# EAGLE design asynclabs_wishield_v2 (EAGLE 5.06)
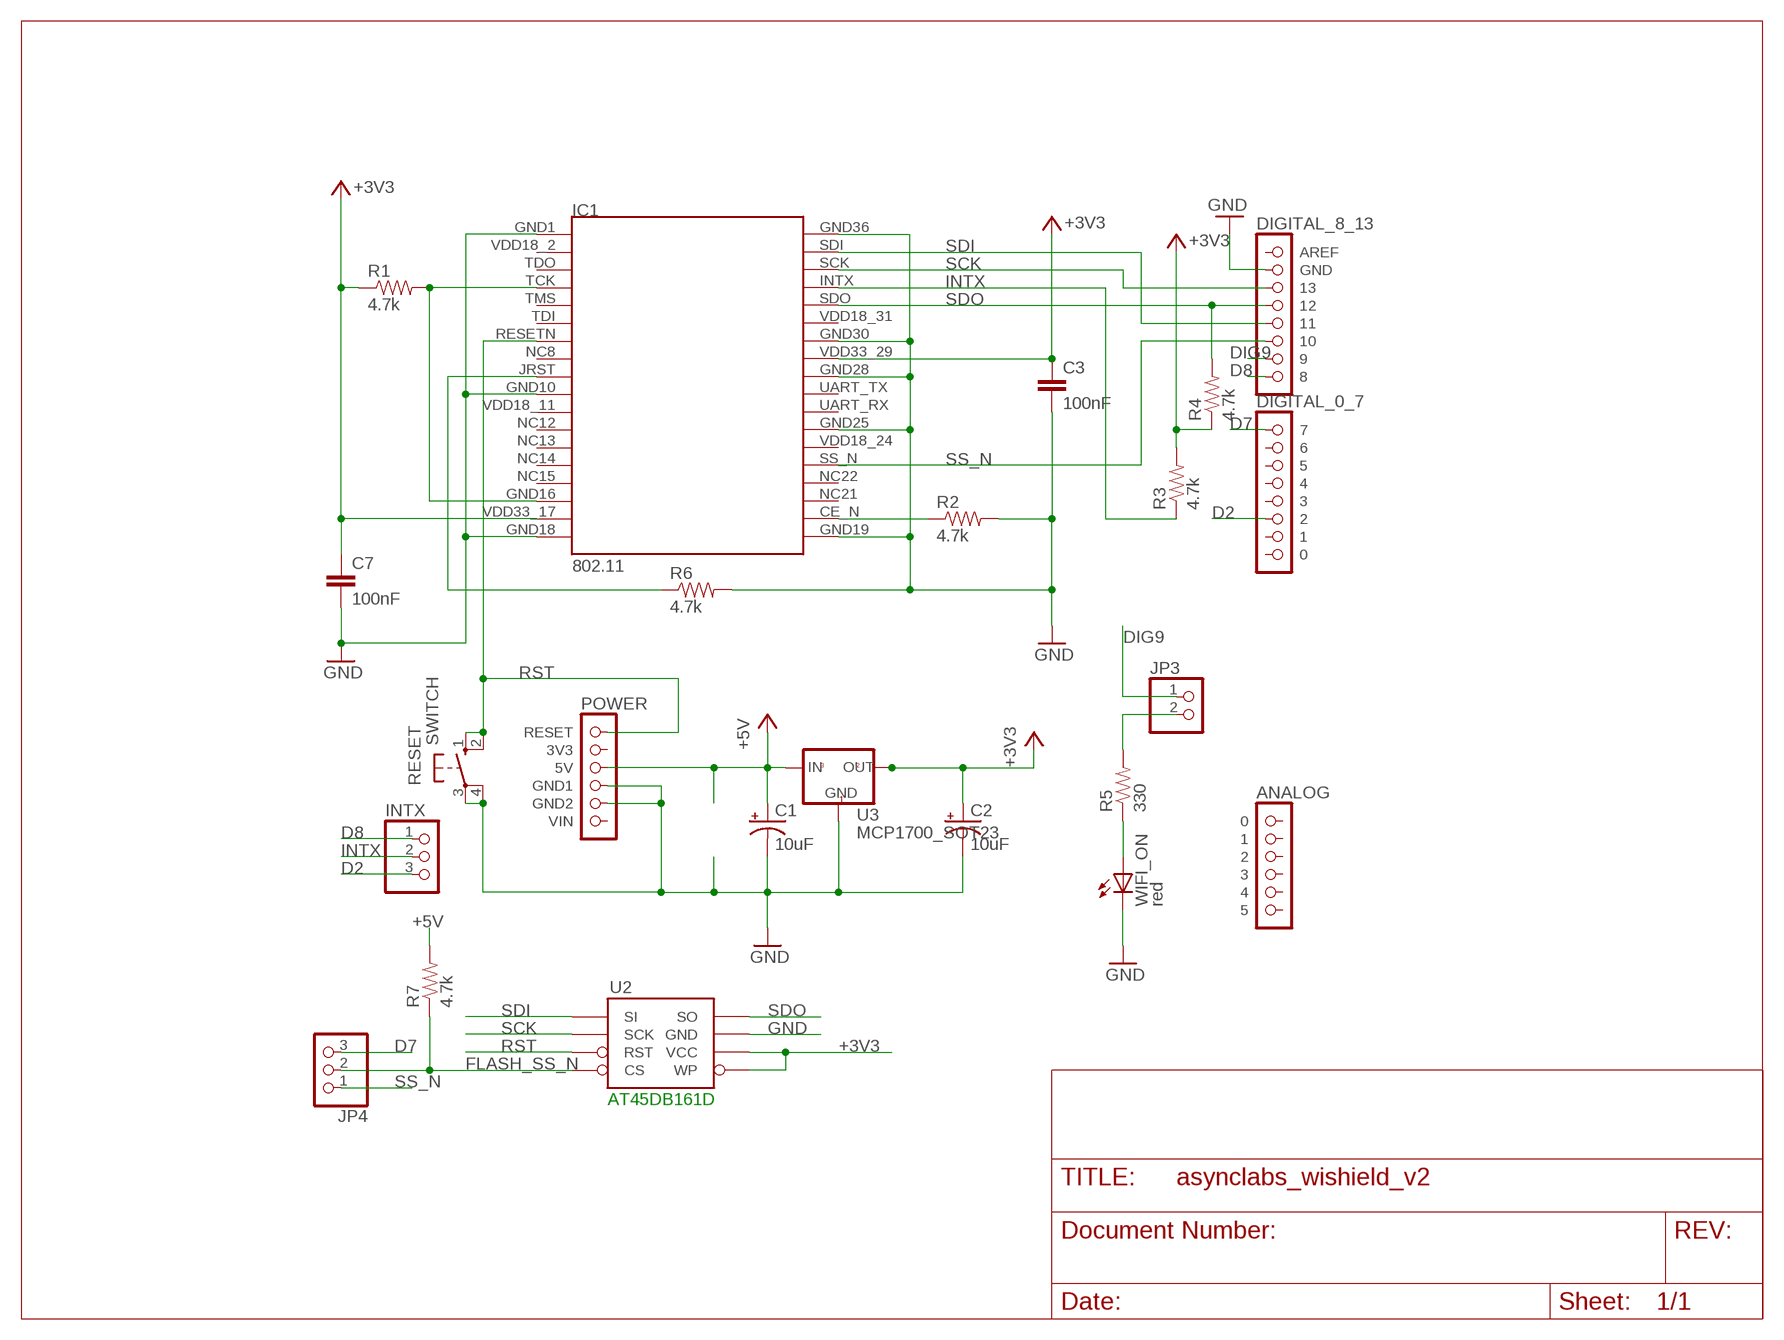
[diagram p0: schematic, sheet 1]

## Parts
C1  10uF  CAP_POL1206  [EIA3216]
C2  10uF  CAP_POL1206  [EIA3216]
C3  100nF  CAPACITOR0603-CAP  [0603-CAP]
C7  100nF  CAPACITOR0603-CAP  [0603-CAP]
IC1  802.11  ZG2100MOD  [ZG2100MOD]
INTX  PINHD3  [PINHD3]
JP3  PINHD2  [PINHD2]
JP4  PINHD3  [PINHD3]
R1  4.7k  RESISTOR0603-RES  [0603-RES]
R2  4.7k  RESISTOR0603-RES  [0603-RES]
R3  4.7k  RESISTOR0603-RES  [0603-RES]
R4  4.7k  RESISTOR0603-RES  [0603-RES]
R5  330  RESISTOR0603-RES  [0603-RES]
R6  4.7k  RESISTOR0603-RES  [0603-RES]
R7  4.7k  RESISTOR0603-RES  [0603-RES]
RESET  SWITCH  [SWITCH]
U2  AT45DB041B  [SO08]
U3  MCP1700_SOT23  [SOT23-3]
U$1  POWER  [1X06]
U$2  ANALOG  [1X06]
U$3  DIGITAL_0_7  [1X08]
U$4  DIGITAL_8_13  [1X08]
WIFI_ON  red  LED0603  [LED-0603]

## Nets
+3V3: C2.A(+) C3.1 C7.1 IC1.VDD33_17 IC1.VDD33_29 R1.1 R3.2 R4.1 U2.5(WP) U2.6(VCC) U3.2(OUT)
+5V: C1.A(+) R7.2 U3.3(IN) U$1.3(5V)
CE_N: IC1.CE_N R2.1
D2: INTX.3 U$3.6
D7: JP4.3 U$3.1
D8: INTX.1 U$4.8
DIG9: JP3.1 U$4.7
FLASH_SS_N: JP4.2 R7.1 U2.4(CS)
GND: C1.C(-) C2.C(-) C3.2 C7.2 IC1.GND1 IC1.GND10 IC1.GND18 IC1.GND19 IC1.GND25 IC1.GND28 IC1.GND30 IC1.GND36 R2.2 R6.2 RESET.3(P) RESET.4(P1) U2.7(GND) U3.1(GND) U$1.4(GND1) U$1.5(GND2) U$4.2(GND) WIFI_ON.C
INTX: IC1.INTX INTX.2 R3.1
JRST: IC1.JRST R6.1
N$1: JP3.2 R5.2
N$2: R5.1 WIFI_ON.A
RST: IC1.RESETN(RSTN) RESET.1(S) RESET.2(S1) U2.3(RST) U$1.1(RESET)
SCK: IC1.SCK U2.2(SCK) U$4.3
SDI: IC1.SDI U2.1(SI) U$4.5
SDO: IC1.SDO R4.2 U2.8(SO) U$4.4
SS_N: IC1.SS_N JP4.1 U$4.6
VDD_TIE: IC1.GND16 IC1.TCK R1.2
Unconnected: IC1.NC8 IC1.NC12 IC1.NC13 IC1.NC14 IC1.NC15 IC1.NC21 IC1.NC22 IC1.TDI IC1.TDO IC1.TMS IC1.UART_RX IC1.UART_TX IC1.VDD18_2 IC1.VDD18_11 IC1.VDD18_24 IC1.VDD18_31 U$1.2(3V3) U$1.6(VIN) U$2.1 U$2.2 U$2.3 U$2.4 U$2.5 U$2.6 U$3.2 U$3.3 U$3.4 U$3.5 U$3.7 U$3.8 U$4.1(AREF)

## Notes on the sheet
- AT45DB161D

## Library data of the parts
C1 C2 = asynlabs:CAP_POL: Capacitor Polarized These are standard SMD and PTH capacitors. Normally 10uF, 47uF, and 100uF in electrolytic and tantalum varieties. Always verify the external diameter of the through hole cap, it varies with capacity, voltage, and manufacturer. The EIA devices should be standard.
C3 C7 = asynlabs:CAPACITOR: Capacitor Standard 0603 ceramic capacitor, and 0.1" leaded capacitor.
IC1 = ZGLIB:ZG2100MOD: ZG2100 Module
INTX JP4 = ZGLIB:PINHD3
JP3 = ZGLIB:PINHD2
R1-R7 = asynlabs:RESISTOR: Resistor Basic schematic elements and footprints for 0603, 1206, and PTH 1/10th watt (small) resistors.
RESET = asynlabs:SWITCH
U2 = asynlabs:AT45DB041B
U3 = asynlabs:MCP1700_SOT23
U$1 = arduino:POWER
U$2 = arduino:ANALOG
U$3 = arduino:DIGITAL_0_7
U$4 = arduino:DIGITAL_8_13
WIFI_ON = asynlabs:LED: LEDs Standard schematic elements and footprints for 5mm, 3mm, 1206, and 0603 sized LEDs. 5mm - Spark Fun Electronics SKU : COM-00529 (and others)

## Board
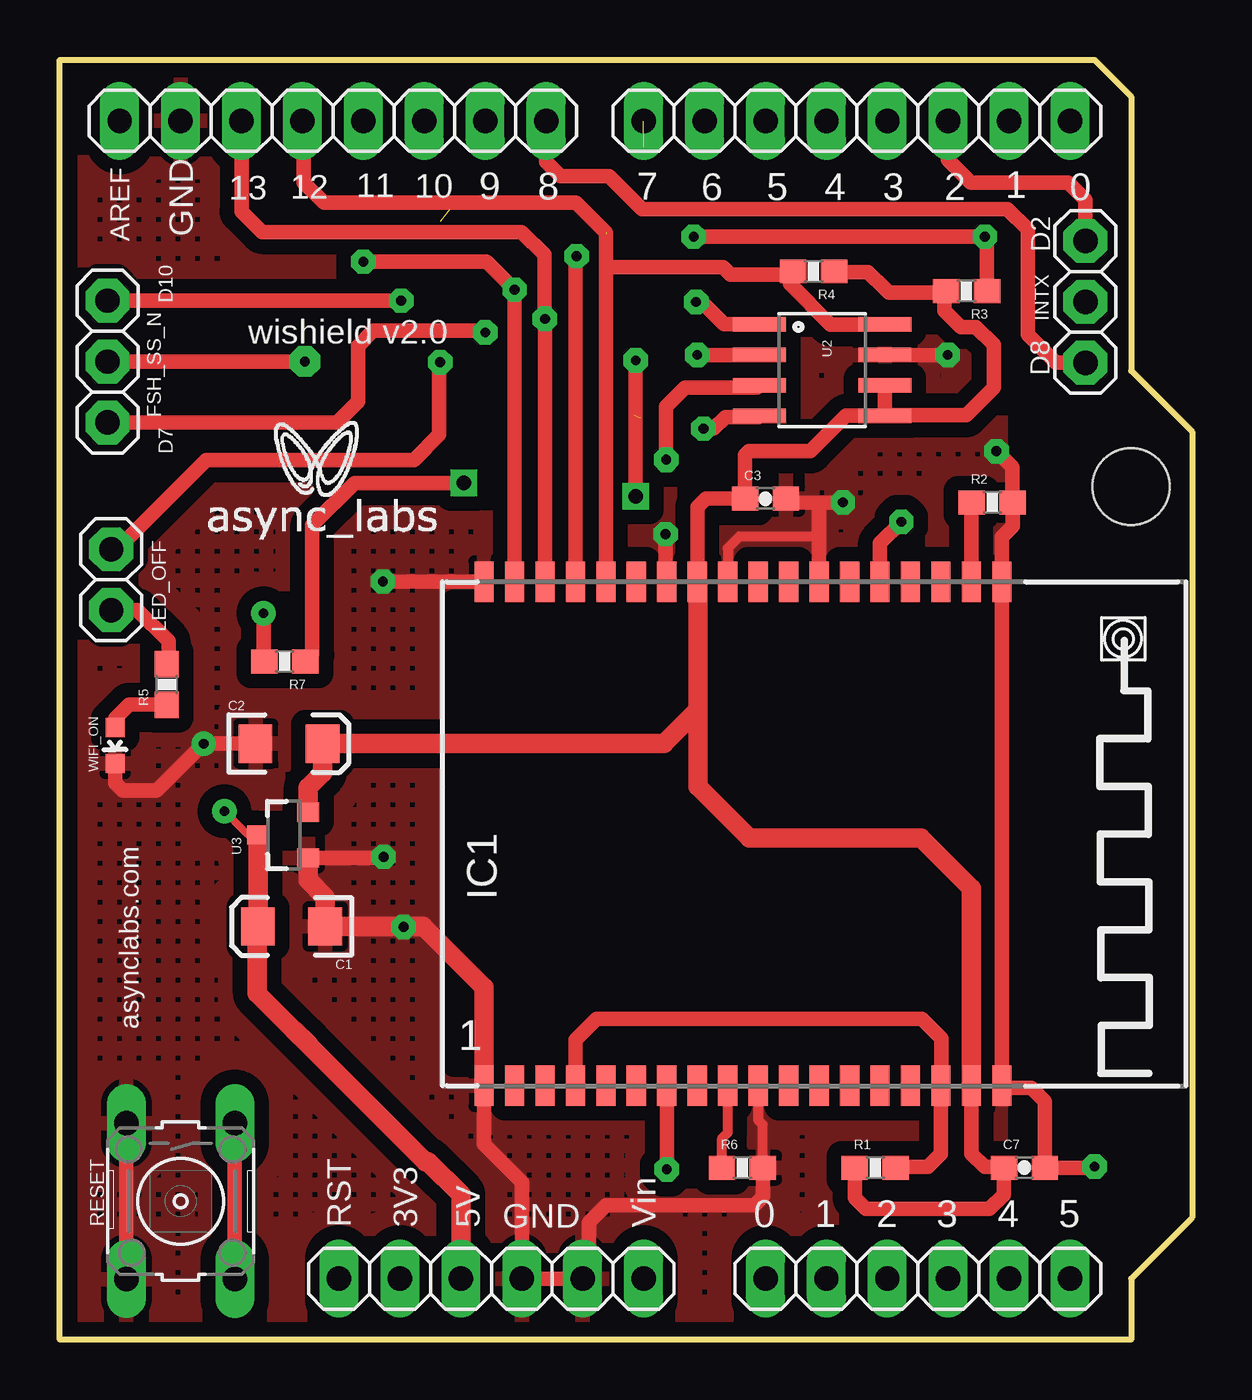
[diagram p1: board, top side]
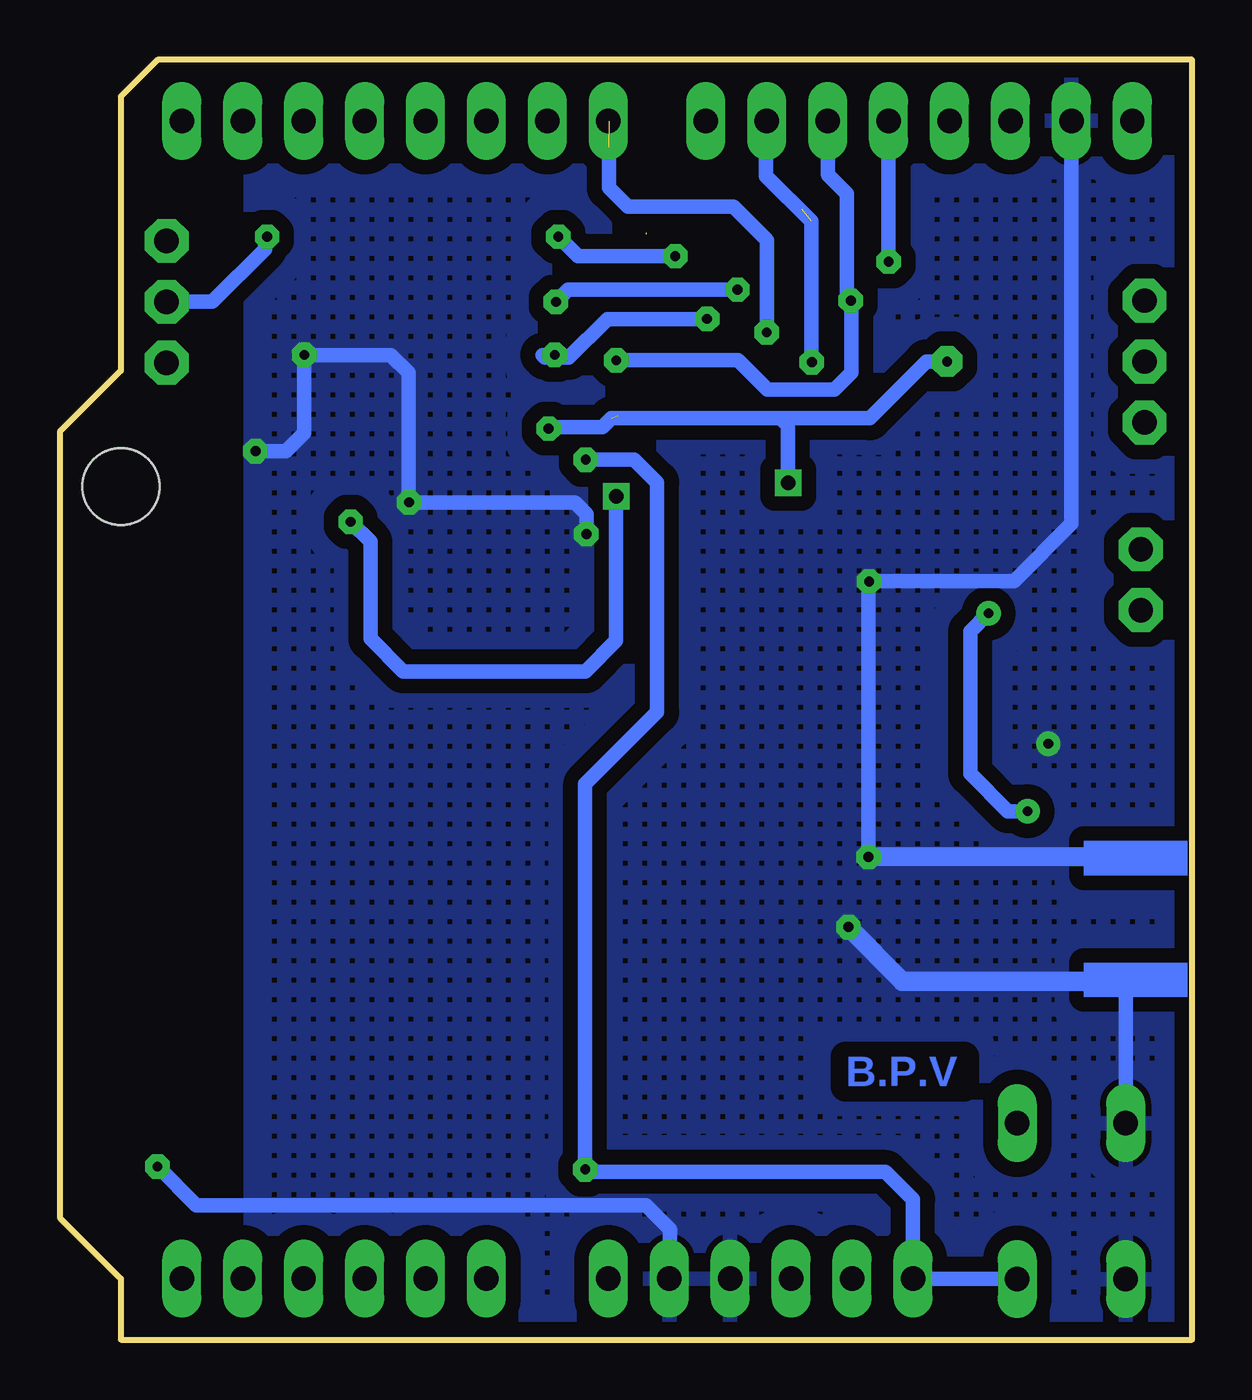
[diagram p2: board, bottom side, seen from below]

Size 47.19 x 53.34 mm. Coordinates in mm from the lower left corner, seen from the top.
Outline: 0,53.34 43.13,53.34 44.65,51.82 44.65,40.39 47.19,37.85 47.19,5.08 44.65,2.54 44.65,0 0,0 0,53.34
Copper layers (1*16): Top 0.035mm / dielectric 1.5mm / Bottom 0.035mm
Design rules: minimum track width 8mil, minimum drill 16mil, track to track 8mil, track to pad 8mil, pad to pad 8mil, via to via 8mil, smd to smd 8mil, copper to edge 10mil, drill to drill 8mil, minimum pad ring 12mil, minimum via ring 10mil, stop-mask expansion 4mil, vias tented up to drill 25mil, thermal gap 10mil
Holes 3.2 mm at 44.65,35.56
tKeepout: area 39.9,30.7 to 46.8,31.7; area 39.8,10.4 to 46.8,11.5
tRestrict: area 16.5,11.6 to 47.2,30.7

### Footprints (pad centres in the part's own frame; a part is rotated, then mirrored left to right if it is on the bottom)
EIA3216 = smd 1.4 x 1.6: A 1.4,0; C -1.4,0
0603-CAP = smd 1.1 x 1: 1 -0.85,0; 2 0.85,0
ZG2100MOD = smd 0.8 x 1.7: CE_N 6.63,10.12; GND1 -13.69,-10.88; GND10 -2.26,-10.88; GND16 5.36,-10.88; GND18 7.9,-10.88; GND19 7.9,10.12; GND25 0.28,10.12; GND28 -3.53,10.12; GND30 -6.07,10.12; GND36 -13.69,10.12; INTX -9.88,10.12; JRST -3.53,-10.88; NC8 -4.8,-10.88; NC12 0.28,-10.88; NC13 1.55,-10.88; NC14 2.82,-10.88; NC15 4.09,-10.88; NC21 5.36,10.12; NC22 4.09,10.12; RESETN -6.07,-10.88; SCK -11.15,10.12; SDI -12.42,10.12; SDO -8.61,10.12; SS_N 2.82,10.12; TCK -9.88,-10.88; TDI -7.34,-10.88; TDO -11.15,-10.88; TMS -8.61,-10.88; UART_RX -0.99,10.12; UART_TX -2.26,10.12; VDD18_2 -12.42,-10.88; VDD18_11 -0.99,-10.88; VDD18_24 1.55,10.12; VDD18_31 -7.34,10.12; VDD33_17 6.63,-10.88; VDD33_29 -4.8,10.12
PINHD3 = drill 1.016 pad 1.829 octagon: 1 -2.54,0; 2 0,0; 3 2.54,0
PINHD2 = drill 1.016 pad 1.829 octagon: 1 -1.27,0; 2 1.27,0
0603-RES = smd 1.1 x 1: 1 -0.85,0; 2 0.85,0
SWITCH = drill 1.016 long: 1 -3.251,2.261; 2 3.251,2.261; 3 -3.251,-2.261; 4 3.251,-2.261
SO08 = smd 0.61 x 2.21: 1 -1.905,-2.616; 2 -0.635,-2.616; 3 0.635,-2.616; 4 1.905,-2.616; 5 1.905,2.616; 6 0.635,2.616; 7 -0.635,2.616; 8 -1.905,2.616
SOT23-3 = smd 0.8 x 0.9: 1 -0.95,-1; 2 0.95,-1; 3 0,1.1
1X06 = drill 1.016 long: 1 -6.35,0; 2 -3.81,0; 3 -1.27,0; 4 1.27,0; 5 3.81,0; 6 6.35,0
1X08 = drill 1.016 long: 1 -8.89,0; 2 -6.35,0; 3 -3.81,0; 4 -1.27,0; 5 1.27,0; 6 3.81,0; 7 6.35,0; 8 8.89,0
LED-0603 = smd 0.8 x 0.8: A 0,-0.75; C 0,0.75

### Placement (x,y rotation side)
C1  9.65,17.22 180 top
C2  9.55,24.84 0 top
C3  29.41,35.05 0 top
C7  40.21,7.16 0 top
IC1  31.37,21.46 0 top
INTX  42.75,43.26 90 top
JP3  2.13,31.67 270 top
JP4  1.98,40.77 270 top
R1  33.99,7.16 0 top
R2  38.86,34.9 0 top
R3  37.8,43.71 180 top
R4  31.42,44.53 180 top
R5  4.45,27.31 90 top
R6  28.45,7.16 0 top
R7  9.37,28.27 180 top
RESET  5.03,5.77 270 top
U2  31.78,40.41 270 top
U3  9.35,21.03 90 top
U$1  17.98,2.54 0 top
U$2  35.76,2.54 0 top
U$3  33.22,50.8 0 top
U$4  11.38,50.8 0 top
WIFI_ON  2.3,24.76 180 top

### Tracks (layer width: path | path; a pad name or v marks a point on that pad's centre or on a via)
+3V3
  Top 0.305: U2.5 34.42,38.53 | 32.3,44.5 R4.1
  Top 0.61: 26.59,31.56 IC1.VDD33_29 26.57,34.7 26.92,35.05 C3.1 28.56,36.87 28.73,37.03 31.29,37.03 32.77,38.51 U2.5 U2.6 | R1.1 33.14,5.9 33.59,5.44 38.75,5.44 39.34,6.03 C7.1 39.33,7.19 38.55,7.19 38,7.75 IC1.VDD33_17 | 32.3,44.5 33.68,44.5 34.38,43.8 34.55,43.63 36.86,43.63 | 34.42,38.53 37.78,38.53 38.92,39.68 38.92,41.47 38.18,42.21 37.55,42.21 36.86,42.9 36.86,43.63 | 36.86,43.63 R3.2
  Top 0.813: IC1.VDD33_17 38,18.8 35.89,20.9 28.75,20.9 26.59,23.06 26.59,26.26 | 26.59,26.26 26.59,31.56 | 26.59,26.26 25.17,24.84 C2.A 10.95,23.62 10.35,23.02 U3.2
+5V  (via drill 0.41 pad 1.02)
  Top 0.203: 8.48,28.25 8.51,28.27 R7.2
  Top 0.305: U3.3 7.85,21.03 v6.86,22.02
  Top 0.61: v8.48,30.28 8.48,28.31 R7.2
  Top 0.813: U$1.3 16.71,6.05 15.34,7.42 15.24,7.42 9.74,12.92 | 9.74,12.92 8.23,14.43 8.23,17.2 C1.A U3.3 | 9.74,12.92 10.36,12.29
  Bottom 0.61: v6.86,22.02 7.68,22.02 9.24,23.59 9.24,29.52 v8.48,30.28
CE_N
  Top 0.61: IC1.CE_N 38,34.89 R2.1
D2
  Top 0.61: 37.03,49.71 U$3.6 37.02,49.19 37.98,48.23 42.03,48.23 42.75,47.51 INTX.3
D7  (via drill 0.41 pad 1.02)  (1 unrouted)
  Top 0.61: JP4.3 11.56,38.23 12.43,39.1 12.43,41.42 13.06,42.05 17.67,42.05 v17.73,41.99
  Bottom 0.305: 24.33,49.71 24.33,49.23
  Bottom 0.61: v17.73,41.99 17.73,45.83 19.12,47.22 23.52,47.22 24.31,48.01 24.31,50.78 U$3.1
D8
  Top 0.61: U$4.8 20.27,49.1 20.87,48.5 22.88,48.5 24.25,47.13 39.5,47.13 40.35,46.28 40.35,41.89 41.51,40.73 INTX.1
DIG9  (via drill 0.41 pad 1.02)  (1 unrouted)
  Top 0.61: JP3.1 2.38,32.94 6.1,36.67 14.76,36.67 15.81,37.72 15.81,40.71 v15.85,40.74
  Bottom 0.305: 16.26,47.12 16.28,47.12 | v15.85,40.74 15.88,40.77
  Bottom 0.61: 15.88,40.77 15.88,46.61 17.76,48.5 17.76,50.77 U$4.7
FLASH_SS_N  (via drill 0.41 pad 1.02, 0.41 pad 1.27, 0.6)  (1 unrouted)
  Top 0.203: 10.52,28.55 10.24,28.27 R7.1
  Top 0.61: v10.21,40.77 JP4.2 | 10.52,28.55 10.52,33.95 12.27,35.71 v16.84,35.71 v16.87,35.69 | v26.82,37.97 27.25,37.97 27.73,38.46 29.11,38.46 U2.4
  Bottom 0.305: 23.9,38.48 23.93,38.51
  Bottom 0.61: v10.21,40.77 11.08,40.77 13.43,38.41 17.15,38.41 | 17.15,38.41 24.2,38.41 24.57,38.04 26.76,38.04 v26.82,37.97 | v16.84,35.71 16.84,38.1 17.15,38.41
GND  (via drill 0.41 pad 1.02)
  Top 0.305: 5.97,24.87 8.13,24.87 C2.C | v13.46,31.6 13.44,31.62
  Top 0.406: R6.2 29.3,8.95 29.11,9.14 IC1.GND10 | IC1.GND18 40.45,10.58 41.05,9.98 41.05,7.21 | IC1.GND30 | IC1.GND28 27.84,32.99 28.32,33.48 31.44,33.48 31.65,33.17
  Top 0.61: IC1.GND10 | IC1.GND1 17.68,8.13 19.25,6.55 U$1.4 U$1.5 22.06,2.81 22.06,4.89 22.77,5.6 28.95,5.6 29.3,5.94 R6.2 | RESET.4 RESET.3 | 31.65,34.9 31.65,33.17 IC1.GND25 | 31.65,34.9 | 31.52,34.9 31.65,34.9 | 31.52,34.9 30.26,34.9 C3.2 | v37.01,41.05 U2.7 | v32.64,34.9 31.52,34.9 | v39.04,37.03 39.71,36.36 R2.2 39.73,34.89 39.73,33.91 39.27,33.45 IC1.GND19 IC1.GND18 39.36,10.49 40.49,10.49 41.06,9.92 C7.2 43.08,7.16 v43.13,7.21 | 12.42,17.22 14.22,17.22 | U3.1 13.45,20.08 v13.49,20.12 | v13.46,31.6 17.66,31.6 IC1.GND36 | C2.C v5.99,24.84 4.03,22.88 2.62,22.88 2.3,23.2 WIFI_ON.C | v25.25,33.58 25.25,31.63 IC1.GND30 | v14.33,17.2 14.53,17.2 14.55,17.22
  Top 0.813: 12.42,17.22 C1.C 11.05,18.44 10.34,19.15 U3.1 | 12.42,17.22 14.1,17.22 | IC1.GND1 17.68,14.68 15.14,17.22 14.55,17.22 12.42,17.22
  Bottom 0.406: U$1.5 21.77,2.57
  Bottom 0.61: U$1.5 21.77,2.54 | v39.04,37.03 37.77,37.03 37.01,37.8 v37.01,41.05 33.4,41.05 32.66,40.31 32.66,34.93 v32.64,34.9 25.73,34.9 25.25,34.42 v25.25,33.58 | v13.49,20.12 13.49,31.57 v13.46,31.6 13.44,31.62 7.42,31.62 5.03,34.01 U$4.2 | RESET.3 2.77,14.94 | 21.77,2.57 21.77,4.59 22.77,5.6 41.52,5.6 v43.13,7.21
  Bottom 0.813: v13.49,20.12 3.15,20.14 | 2.77,14.94 12.07,14.94 v14.33,17.2
  pour Bottom (isolate 0.61, hatched): 0.08,53.39 39.24,53.39 39.24,0.1 0.08,0.1 0.08,2.26 0,2.26 0,53.47
  pour Top (isolate 0.61, hatched): 0.05,53.37 39.22,53.37 39.22,0.08 0.05,0.08 0.05,2.24 -0.03,2.24 -0.03,53.44
INTX  (via drill 0.41 pad 1.02)
  Top 0.305: IC1.INTX | v38.56,45.97 38.62,45.71
  Top 0.61: IC1.INTX 21.49,45.11 v21.54,45.16 | v26.42,45.97 v38.56,45.97 38.65,45.89 R3.1
  Bottom 0.61: v21.54,45.16 25.6,45.16 v26.42,45.97 | INTX.2 40.85,43.26 38.65,45.46 38.65,45.89 v38.56,45.97
JRST
  Top 0.406: R6.1 27.6,8.4 27.84,8.64 IC1.JRST
  Top 0.61: IC1.JRST
N$1
  Top 0.61: JP3.2 3.23,30.4 4.52,29.11 4.52,28.22 R5.2
N$2
  Top 0.61: WIFI_ON.A 2.3,25.89 2.88,26.47 4.44,26.47 R5.1
RST  (via drill 0.41 pad 1.02, 0.6)  (1 unrouted)
  Top 0.305: RESET.2 v7.32,2.54 | IC1.RESETN | 29.34,39.78 29.97,39.78 30,39.8
  Top 0.406: U2.3 29.34,39.78
  Top 0.61: RESET.2 RESET.1 | IC1.RESETN | v25.27,36.68 25.27,38.9 26.05,39.68 29.06,39.68 U2.3 | v25.3,7.09 IC1.RESETN
  Bottom 0.305: IC1.RESETN 25.27,10.61
  Bottom 0.61: v7.32,2.54 U$1.1 11.63,5.85 12.77,6.99 25.2,6.99 v25.3,7.09 25.3,23.15 22.3,26.15 22.3,35.73 23.25,36.68 v25.27,36.68
SCK  (via drill 0.41 pad 1.02)
  Top 0.305: IC1.SCK
  Top 0.61: IC1.SCK v20.22,42.55 20.19,42.57 20.19,45.22 19.24,46.17 8.42,46.17 7.57,47.02 U$4.3 | v26.57,41.05 U2.2
  Bottom 0.61: v20.22,42.55 24.37,42.55 25.98,40.93 26.97,40.93 27.08,41.05 v26.57,41.05
SDI  (via drill 0.41 pad 1.02)
  Top 0.305: v18.95,43.77 v18.95,43.76 | v26.52,43.26 26.52,43.23 | 29.13,42.29 U2.1
  Top 0.61: v12.65,44.93 17.78,44.93 v18.95,43.77 | v18.95,43.77 v18.95,43.76 | v18.95,43.77 IC1.SDI | v26.52,43.26 26.75,43.26 27.68,42.32 U2.1
  Bottom 0.61: U$4.5 v12.65,44.93 | v18.95,43.76 26.01,43.76 v26.52,43.26
SDO  (1 unrouted)
  Top 0.305: IC1.SDO | 22.76,46.08 22.76,46.03 | R4.2 30.61,44.49
  Top 0.406: 30.71,44.63 30.57,44.63 R4.2
  Top 0.61: IC1.SDO 22.76,44.54 | 22.76,44.54 22.76,46.14 21.51,47.39 11,47.39 10.16,48.23 10.16,50.75 U$4.4 | U2.8 32.13,42.32 30.43,44.01 30.43,44.39 | 30.43,44.39 R4.2 | 30.43,44.39 27.94,44.39 27.63,44.7 22.92,44.7 22.76,44.54
SS_N  (via drill 0.41 pad 1.02, 0.6)
  Top 0.61: JP4.1 v14.22,43.31 | v24,40.82 v24,35.15 v23.98,35.13 | IC1.SS_N 34.19,33.2 v35.08,34.09
  Bottom 0.305: v14.22,43.31 14.33,43.41
  Bottom 0.61: U$4.6 15.19,48.57 14.38,47.76 14.38,43.47 v14.22,43.31 14.2,43.29 14.2,40.3 14.91,39.59 17.7,39.59 18.93,40.82 v24,40.82 | v24,35.15 24,29.13 25.28,27.85 32.88,27.85 34.25,29.22 34.25,33.26 v35.08,34.09
VDD_TIE
  Top 0.61: IC1.TCK 21.49,12.48 22.37,13.37 35.93,13.37 36.74,12.56 36.74,10.6 IC1.GND16 36.73,7.73 36.18,7.19 34.86,7.19 R1.2
(copper drawn outside any net)
  shapes: Bottom area x2

### Text on the board
Bottom: B.P.V
tNames: 13 | 12 | 11 | 10 | 9 | 8 | 6 | 5 | 4 | 3 | 2 | 1 | 0 | 7 | AREF | GND | D2 | D10 | wishield v2.0 | D8 | FSH_SS_N | D7 | LED_OFF | asynclabs.com | GND | RST | 3V3 | 5V | Vin | 0 | 1 | 2 | 3 | 4 | 5